# Altium schematic sheet LP Filter.SchDoc
size A4; SheetNumber: 6; SheetTotal: 7
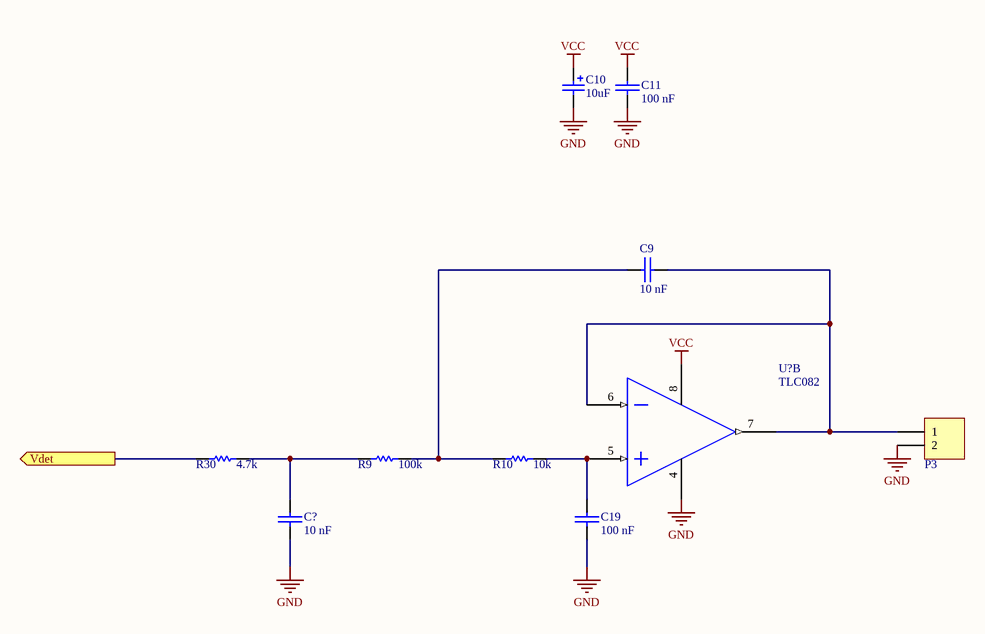
[diagram p0: LP Filter.SchDoc]

## Parts
C9  10 nF  [ece-RAD0.2]
C10  10uF  [ece-CAPAD2TH0.3]
C11  100 nF  [ece-RAD0.2]
C19  100 nF  [ece-RAD0.2]
C?  10 nF  [ece-RAD0.2]
P3  Connector2way  [ece-TER-2.02]  (value not drawn)
R9  100k  [ece-AXIAL0.4]
R10  10k  [ece-AXIAL0.4]
R30  4.7k  [ece-AXIAL0.4]
U?  TLC082  [ECE-DIP8]  (part B of 2)

## Ports
Vdet (out)

## Nets
GND: C10.2 C11.2 C19.2 C?.2 P3.2 U?.4(GND)
VCC: C10.1 C11.1 U?.8(V(+))
Vdet: R30.1 ; port Vdet
NetC9_1: C9.1 R9.2 R10.1
NetC9_2: C9.2 P3.1 U?.6(IN2(-)) U?.7(OUT2)
NetC19_1: C19.1 R10.2 U?.5(IN2(+))
NetC?_1: C?.1 R9.1 R30.2

## Library data of the parts
C9 C11 C19 C? = CAP: Capacitor Non Polarised Through Hole
  C9 C?: Value: 10 nF
  C11 C19: Value: 100 nF
C10 = CAP 22uF TH: Polarized Capacitor (Radial); Manufacturer: Generic Components; Class I: Passive; Published: 8-Jun-2000; Revision: July-2002: Re-released for DXP Platform.; Publisher: Altium Limited; Class II: Capacitor; Value: 10uF
P3 = Connector2way: 2 way screw connector
R9 R10 R30 = Res1: Resistor; Published: 8-Jun-2000; LatestRevisionDate: 17-Jul-2002; LatestRevisionNote: Re-released for DXP Platform.; PackageReference: AXIAL-0.3; Publisher: Altium Limited
  R9: Value: 100k
  R10: Value: 10k
  R30: Value: 4.7k
U? = TLC082: Value: TLC082